# EAGLE design KEF_Weather_Station (EAGLE 9.6.2)
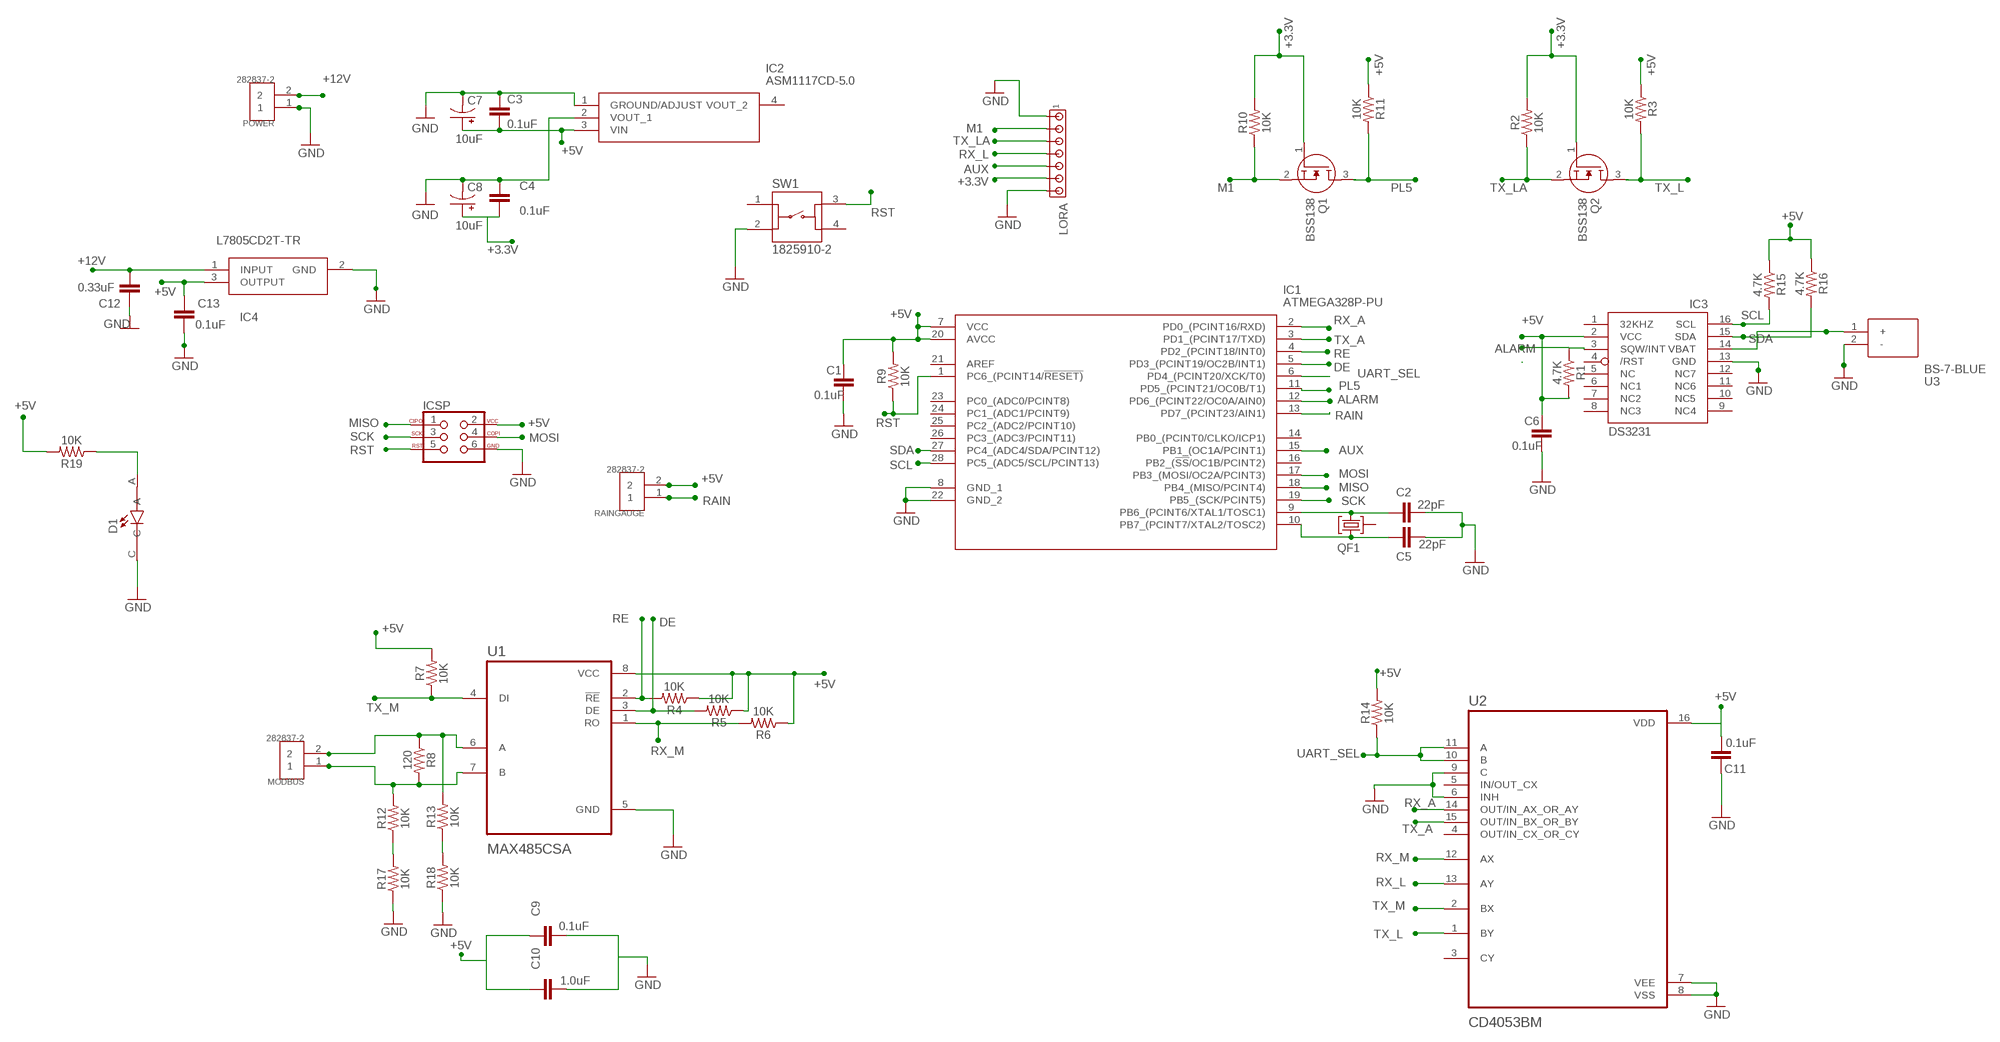
[diagram p0: schematic, sheet 1]

## Parts
C1  0.1uF  1.0UF-1206-50V-10%  [1206]
C2  22pF  1.0UF-1206-50V-10%  [1206]
C3  0.1uF  1.0UF-1206-50V-10%  [1206]
C4  0.1uF  1.0UF-1206-50V-10%  [1206]
C5  22pF  1.0UF-1206-50V-10%  [1206]
C6  0.1uF  1.0UF-1206-50V-10%  [1206]
C7  10uF  10UF-POLAR-EIA3216-16V-10%(TANT)  [EIA3216]
C8  10uF  10UF-POLAR-EIA3216-16V-10%(TANT)  [EIA3216]
C9  0.1uF  1.0UF-1206-50V-10%  [1206]
C10  1.0uF  1.0UF-1206-50V-10%  [1206]
C11  0.1uF  1.0UF-1206-50V-10%  [1206]
C12  0.33uF  1.0UF-1206-50V-10%  [1206]
C13  0.1uF  1.0UF-1206-50V-10%  [1206]
D1  LTST-C230KFKT  [LEDC3216X110]
IC1  ATMEGA328P-PU  [DIP794W53P254L3467H457Q28N]
IC2  ASM1117CD-5.0  [SOT229P700X180-4N]
IC3  DS3231/SO  [SO16W]
IC4  L7805CD2T-TR  [L7805CD2T]
ICSP  AVR_SPI_PROG_3X2NS  [2X3-NS]
LORA  MTA07-100  [10X07MTA]
MODBUS  282837-2  [TE_282837-2]
POWER  282837-2  [TE_282837-2]
Q1  BSS138  [SOT95P240X120-3N]
Q2  BSS138  [SOT95P240X120-3N]
QF1  8M10AHC49T  [HC49U]
R1  4.7K  10OHM-1206-1/4W-1%  [1206]
R2  10K  10OHM-1206-1/4W-1%  [1206]
R3  10K  10OHM-1206-1/4W-1%  [1206]
R4  10K  10OHM-1206-1/4W-1%  [1206]
R5  10K  10OHM-1206-1/4W-1%  [1206]
R6  10K  10OHM-1206-1/4W-1%  [1206]
R7  10K  10OHM-1206-1/4W-1%  [1206]
R8  120  10OHM-1206-1/4W-1%  [1206]
R9  10K  10OHM-1206-1/4W-1%  [1206]
R10  10K  10OHM-1206-1/4W-1%  [1206]
R11  10K  10OHM-1206-1/4W-1%  [1206]
R12  10K  10OHM-1206-1/4W-1%  [1206]
R13  10K  10OHM-1206-1/4W-1%  [1206]
R14  10K  10OHM-1206-1/4W-1%  [1206]
R15  4.7K  10OHM-1206-1/4W-1%  [1206]
R16  4.7K  10OHM-1206-1/4W-1%  [1206]
R17  10K  10OHM-1206-1/4W-1%  [1206]
R18  10K  10OHM-1206-1/4W-1%  [1206]
R19  10K  10OHM-1206-1/4W-1%  [1206]
RAINGAUGE  282837-2  [TE_282837-2]
SW1  1825910-2  [TE_1825910-2]
U1  MAX485CSA  [SOIC127P600X175-8N]
U2  CD4053BM  [SOIC127P600X175-16N]
U3  BS-7-BLUE  [BS-7-BLUE_1]

## Nets
+3.3V: C4.2 C8.+ LORA.6 Q1.1(G) Q2.1(G) R2.2 R10.2
+5V: C1.1 C3.2 C6.1 C7.+ C9.1 C10.1 C11.2 C13.1 IC1.7(VCC) IC1.20(AVCC) IC2.3(VIN) IC3.2(VCC) IC4.3(OUTPUT) ICSP.2 R1.2 R3.1 R4.1 R5.1 R6.1 R7.2 R9.2 R11.1 R14.2 R15.1 R16.1 R19.2 RAINGAUGE.2 U1.8(VCC) U2.16(VDD)
+12V: C12.1 IC4.1(INPUT) POWER.2
ALARM: IC1.12(PD6_(PCINT22/OC0A/AIN0)) IC3.3(SQW/INT) R1.1
AUX: IC1.15(PB1_(OC1A/PCINT1)) LORA.5
DE: IC1.5(PD3_(PCINT19/OC2B/INT1)) R5.2 U1.3(DE)
GND: C1.2 C2.2 C3.1 C4.1 C5.2 C6.2 C7.- C8.- C9.2 C10.2 C11.1 C12.2 C13.2 D1.C IC1.8(GND_1) IC1.22(GND_2) IC2.1(GROUND/ADJUST) IC2.2(VOUT_1) IC3.13(GND) IC4.2(GND) ICSP.6 LORA.1 LORA.7 POWER.1 R17.1 R18.1 SW1.2 U1.5(GND) U2.6(INH) U2.7(VEE) U2.8(VSS) U2.9(C) U3.2(-)
M1: LORA.2 Q1.2(S) R10.1
MISO: IC1.18(PB4_(MISO/PCINT4)) ICSP.1
MOSI: IC1.17(PB3_(MOSI/OC2A/PCINT3)) ICSP.4
N$1: R12.1 R17.2
N$2: IC3.14(VBAT) U3.1(+)
N$3: C5.1 IC1.10(PB7_(PCINT7/XTAL2/TOSC2)) QF1.1
N$4: C2.1 IC1.9(PB6_(PCINT6/XTAL1/TOSC1)) QF1.3
N$5: R13.1 R18.2
N$6: D1.A R19.1
N$10: MODBUS.1 R8.2 R12.2 U1.7(B)
N$11: MODBUS.2 R8.1 R13.2 U1.6(A)
PL5: IC1.11(PD5_(PCINT21/OC0B/T1)) Q1.3(D) R11.2
RAIN: IC1.13(PD7_(PCINT23/AIN1)) RAINGAUGE.1
RE: IC1.4(PD2_(PCINT18/INT0)) R4.2 U1.2(!RE)
RST: IC1.1(PC6_(PCINT14/!RESET)) ICSP.5 R9.1 SW1.3
RX_A: IC1.2(PD0_(PCINT16/RXD)) U2.14(OUT/IN_AX_OR_AY)
RX_L: LORA.4 U2.13(AY)
RX_M: R6.2 U1.1(RO) U2.12(AX)
SCK: IC1.19(PB5_(SCK/PCINT5)) ICSP.3
SCL: IC1.28(PC5_(ADC5/SCL/PCINT13)) IC3.16(SCL) R15.2
SDA: IC1.27(PC4_(ADC4/SDA/PCINT12)) IC3.15(SDA) R16.2
TX_A: IC1.3(PD1_(PCINT17/TXD)) U2.15(OUT/IN_BX_OR_BY)
TX_L: Q2.3(D) R3.2 U2.1(BY)
TX_LA: LORA.3 Q2.2(S) R2.1
TX_M: R7.1 U1.4(DI) U2.2(BX)
UART_SEL: IC1.6(PD4_(PCINT20/XCK/T0)) R14.1 U2.10(B) U2.11(A)
Unconnected: IC1.14(PB0_(PCINT0/CLKO/ICP1)) IC1.16(PB2_(!SS!/OC1B/PCINT2)) IC1.21(AREF) IC1.23(PC0_(ADC0/PCINT8)) IC1.24(PC1_(ADC1/PCINT9)) IC1.25(PC2_(ADC2/PCINT10)) IC1.26(PC3_(ADC3/PCINT11)) IC2.4(VOUT_2) IC3.1(32KHZ) IC3.4(/RST) IC3.5(NC) IC3.6(NC1) IC3.7(NC2) IC3.8(NC3) IC3.9(NC4) IC3.10(NC5) IC3.11(NC6) IC3.12(NC7) QF1.2 SW1.1 SW1.4 U2.3(CY) U2.4(OUT/IN_CX_OR_CY) U2.5(IN/OUT_CX)

## Library data of the parts
C1-C6 C9 C11-C13 = SparkFun-Capacitors:1.0UF: 1µF ceramic capacitors A capacitor is a passive two-terminal electrical component used to store electrical energy temporarily in an electric field.; PROD_ID: CAP-09822; VALUE: 1.0uF
C7 C8 = SparkFun-Capacitors:10UF-POLAR: 10.0µF polarized capacitors A capacitor is a passive two-terminal electrical component used to store electrical energy temporarily in an electric field.; PROD_ID: CAP-00811
C10 = SparkFun-Capacitors:1.0UF: 1µF ceramic capacitors A capacitor is a passive two-terminal electrical component used to store electrical energy temporarily in an electric field.; PROD_ID: CAP-09822
D1 = LTST-C230KFKT:LTST-C230KFKT: LED ORANGE CLEAR 1206 SMD Check availability <https://pricing.snapeda.com/parts/LTST-C230KFKT/Lite-On%20Inc./view-part?ref=eda>; AVAILABILITY: In Stock; DESCRIPTION: Orange 605nm LED Indication - Discrete 2V 1206 (3216 Metric); MF: Lite-On Inc.; MP: LTST-C230KFKT; PACKAGE: 1206 Lite-On; PRICE: None; PURCHASE-URL: https://pricing.snapeda.com/search/part/LTST-C230KFKT/?ref=eda
IC1 = SamacSys_Parts:ATMEGA328P-PU: MICROCHIP - ATMEGA328P-PU. - MICROCONTROLLER MCU, 8 BIT, ATMEGA, 20MHZ, DIP-28 Source: Datasheet <http://ww1.microchip.com/downloads/en/DeviceDoc/Atmel-42735-8-bit-AVR-Microcontroller-ATmega328-328P_Datasheet.pdf>; ARROW_PART_NUMBER: ATMEGA328P-PU; ARROW_PRICE-STOCK: https://www.arrow.com/en/products/atmega328p-pu/microchip-technology?region=nac; DESCRIPTION: MICROCHIP - ATMEGA328P-PU. - MICROCONTROLLER MCU, 8 BIT, ATMEGA, 20MHZ, DIP-28; HEIGHT: 4.572mm; MANUFACTURER_NAME: Microchip; MANUFACTURER_PART_NUMBER: ATMEGA328P-PU; MOUSER_PART_NUMBER: 556-ATMEGA328P-PU; MOUSER_PRICE-STOCK: https://www.mouser.co.uk/ProductDetail/Microchip-Technology-Atmel/ATMEGA328P-PU?qs=K8BHR703ZXguOQv3sKbWcg%3D%3D
IC2 = ASM1117CD-5.0:ASM1117CD-5.0: 1A LOW DROPOUT VOLTAGE REGULATOR Source: Datasheet <http://www.advanced-monolithic.com/pdf/ds1117.pdf>; DESCRIPTION: 1A LOW DROPOUT VOLTAGE REGULATOR; HEIGHT: 1.8mm; MANUFACTURER_NAME: Advanced Monolithic Systems; MANUFACTURER_PART_NUMBER: ASM1117CD-5.0
IC3 = DS3231:DS3231: Check availability <https://pricing.snapeda.com/parts/DS3231/Maxim%20Integrated/view-part?ref=eda>; AVAILABILITY: In Stock; DESCRIPTION: Real Time Clock (RTC) IC Clock/Calendar - I²C, 2-Wire Serial 8-SOIC (0.154, 3.90mm Width); MF: Maxim Integrated; MP: DS3231; PACKAGE: SOIC-16 Maxim Integrated; PRICE: None; PURCHASE-URL: https://pricing.snapeda.com/search/part/DS3231/?ref=eda
IC4 = L7805CD2T-TR:L7805CD2T-TR: L7805CD2T-TR, Linear Voltage Regulator, 1.5A 5 V, 3-Pin D2PAK Source: Datasheet <http://www.st.com/web/en/resource/technical/document/datasheet/CD00000444.pdf>; ARROW_PART_NUMBER: L7805CD2T-TR; ARROW_PRICE-STOCK: https://www.arrow.com/en/products/l7805cd2t-tr/stmicroelectronics?region=nac; DESCRIPTION: L7805CD2T-TR, Linear Voltage Regulator, 1.5A 5 V, 3-Pin D2PAK; HEIGHT: 4.56mm; MANUFACTURER_NAME: STMicroelectronics; MANUFACTURER_PART_NUMBER: L7805CD2T-TR; MOUSER_PART_NUMBER: 511-L7805CD2T-TR; MOUSER_PRICE-STOCK: https://www.mouser.co.uk/ProductDetail/STMicroelectronics/L7805CD2T-TR?qs=8tkG3v2%2F4sGtQPO74MZjHw%3D%3D
ICSP = SparkFun-Connectors:AVR_SPI_PROG_3X2: AVR ISP 6 Pin This is the reduced ISP connector for AVR programming. Common on Arduino. This footprint will take up less PCB space and can be used with a 10-pin to 6-pin adapter such as SKU: BOB-08508 **Special note about "TEST_POINT" package. The stop mask is on the top side, so if you want your programming test points to be on the bottom of your board, make sure to place this package on the bottom side of the board. This also ensure that the orientation to program from the bottom side will be correct. SparkFun Products: SparkFun ISP Pogo Adapter <https://www.sparkfun.com/products/11591> - NS Tiny AVR Programmer <https://www.sparkfun.com/products/11801> -PTH
LORA = con-amp:MTA07-100: AMP connector
MODBUS POWER RAINGAUGE = 282837-2:282837-2: TERM BLOCK 5.08MM 2POS SIDE ENTY Check availability <https://pricing.snapeda.com/parts/282837-2/TE%20Connectivity/view-part?ref=eda>; AVAILABILITY: In Stock; COMMENT: 282837-2; DESCRIPTION: Connector Terminal Blocks Receptacle 2 Position 5.08mm Solder Straight Thru-Hole 13.5A/Contact; EU_ROHS_COMPLIANCE: Compliant with Exemptions; MF: TE Connectivity; MP: 282837-2; PACKAGE: None; PRICE: None; PURCHASE-URL: https://pricing.snapeda.com/search/part/282837-2/?ref=eda
Q1 Q2 = SamacSys_Parts:BSS138: N-channel MOSFET,BSS138 0.2A 50V Source: Datasheet <https://www.onsemi.com/pub/Collateral/BSS138-D.PDF>; ARROW_PART_NUMBER: BSS138; ARROW_PRICE-STOCK: https://www.arrow.com/en/products/bss138/on-semiconductor; DESCRIPTION: N-channel MOSFET,BSS138 0.2A 50V; HEIGHT: 1.2mm; MANUFACTURER_NAME: ON Semiconductor; MANUFACTURER_PART_NUMBER: BSS138; MOUSER_PART_NUMBER: 512-BSS138; MOUSER_PRICE-STOCK: https://www.mouser.co.uk/ProductDetail/ON-Semiconductor-Fairchild/BSS138?qs=HK%252BeIG1iaahCeqBvjB4arg%3D%3D
QF1 = crystal:8M10AHC49T: Monolithic Crystal Filters Source: www.vanlong.com; OC_FARNELL: unknown; OC_NEWARK: unknown
R1-R19 = SparkFun-Resistors:10OHM: 10Ω resistor A resistor is a passive two-terminal electrical component that implements electrical resistance as a circuit element. Resistors act to reduce current flow, and, at the same time, act to lower voltage levels within circuits. - Wikipedia; PROD_ID: RES-08705; VALUE: 10
SW1 = 1825910-2:1825910-2: SWITCH TACTILE SPST-NO 0.05A 24V Check availability <https://pricing.snapeda.com/parts/1825910-2/TE%20Connectivity/view-part?ref=eda>; AVAILABILITY: In Stock; COMMENT: 1825910-2; DESCRIPTION: 50 mA SPST Round Actuator 160 Gram Force Tactile Pushbutton Switch; EU_ROHS_COMPLIANCE: Compliant; MF: TE Connectivity; MP: 1825910-2; PACKAGE: None; PRICE: None; PURCHASE-URL: https://pricing.snapeda.com/search/part/1825910-2/?ref=eda
U1 = MAX485CSA:MAX485CSA: Check availability <https://pricing.snapeda.com/parts/MAX485CSA/Maxim%20Integrated/view-part?ref=eda>; AVAILABILITY: In Stock; DESCRIPTION: 1/1 Transceiver Half RS422, RS485 8-SOIC; MF: Maxim Integrated; MP: MAX485CSA; PACKAGE: SOIC-8 Maxim; PRICE: None; PURCHASE-URL: https://pricing.snapeda.com/search/part/MAX485CSA/?ref=eda
U2 = CD4053BM:CD4053BM: Check availability <https://pricing.snapeda.com/parts/CD4053BM/Texas%20Instruments/view-part?ref=eda>; AVAILABILITY: In Stock; DESCRIPTION: 20-V, 2:1 (SPDT), 3-channel analog multiplexer with logic-level conversion 16-SOIC -55 to 125; MF: Texas Instruments; MP: CD4053BM; PACKAGE: SOIC-16 Texas Instruments; PRICE: None; PURCHASE-URL: https://pricing.snapeda.com/search/part/CD4053BM/?ref=eda
U3 = BS-7-BLUE:BS-7-BLUE: HOLDER CR2032 Source: Datasheet <http://www.memoryprotectiondevices.com/datasheets/BS-7-BLUE-datasheet.pdf>; DESCRIPTION: HOLDER CR2032; HEIGHT: mm; MANUFACTURER_NAME: MPD (Memory Protection Devices); MANUFACTURER_PART_NUMBER: BS-7-BLUE

## Board
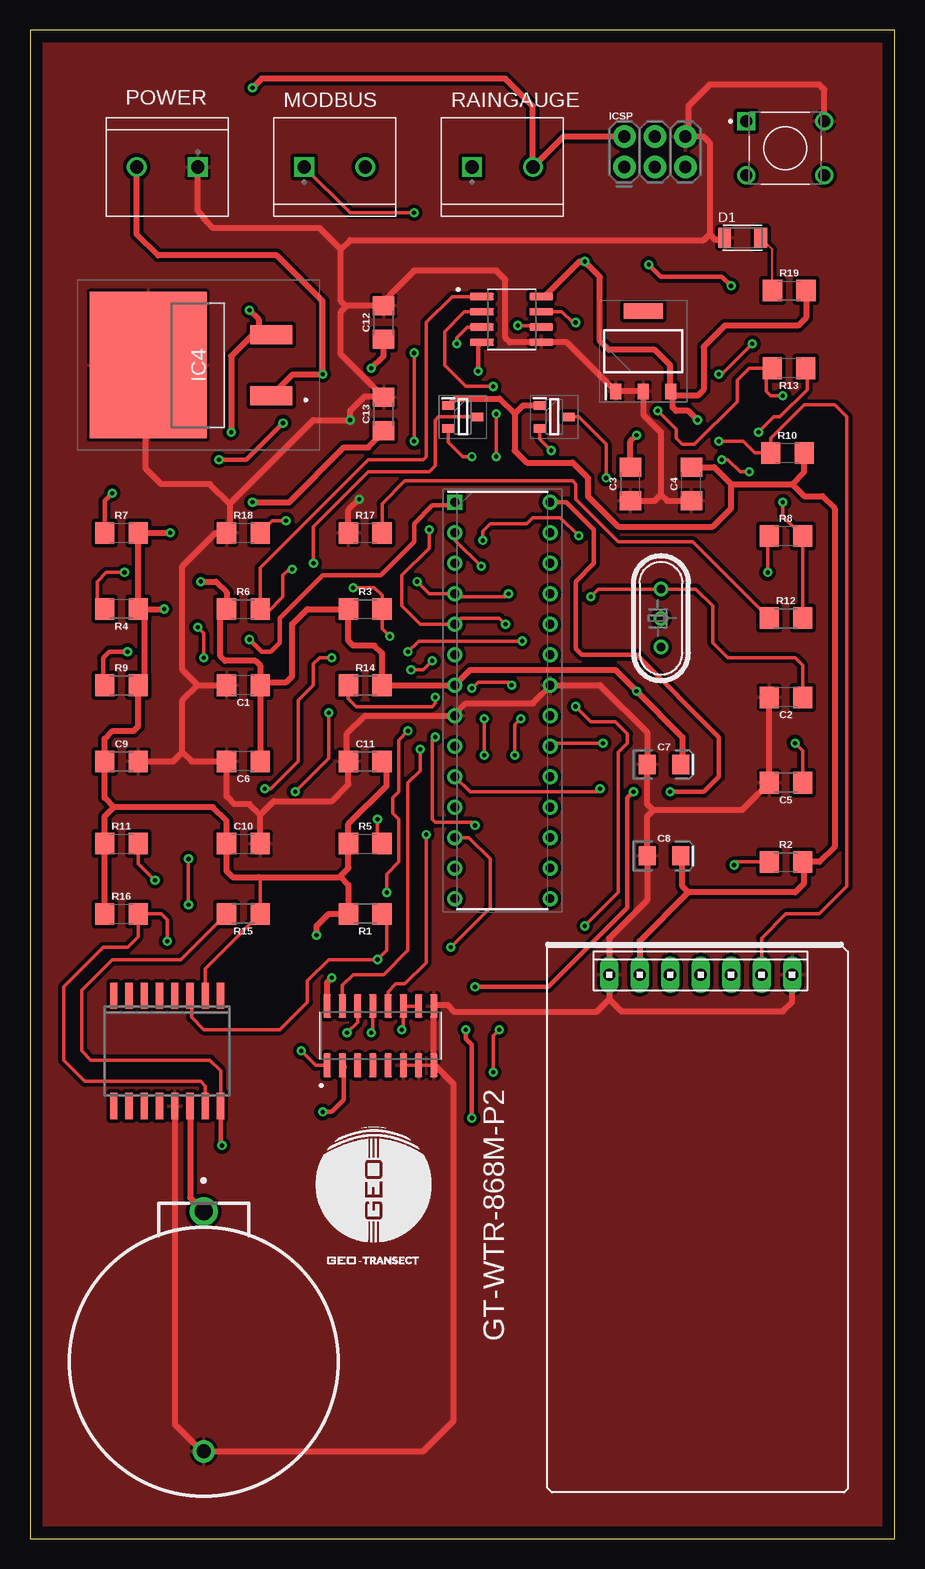
[diagram p1: board, top side]
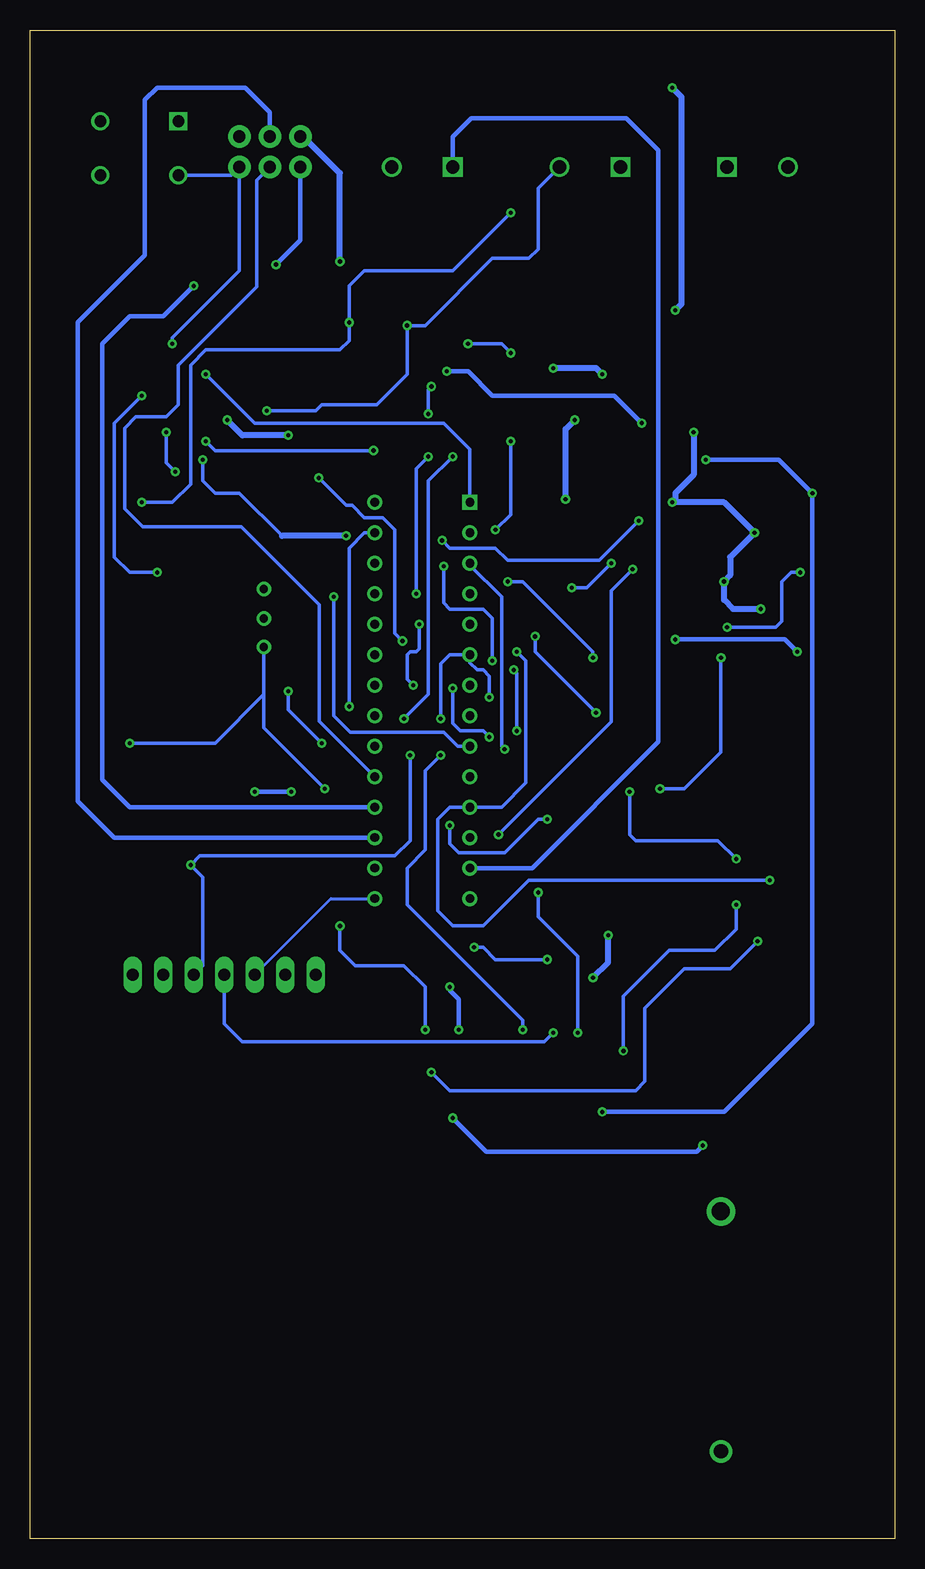
[diagram p2: board, bottom side, seen from below]

Size 72.06 x 125.72 mm. Coordinates in mm from the lower left corner, seen from the top.
Outline: 72.06,0 72.06,125.72 0,125.72 0,0 72.06,0
Copper layers (1*16): Top 0.035mm / dielectric 1.5mm / Bottom 0.035mm
Design rules "default": minimum track width 6mil, minimum drill 0.35mm, track to track 6mil, track to pad 6mil, pad to pad 6mil, via to via 6mil, smd to smd 6mil, copper to edge 40mil, drill to drill 6mil, minimum pad ring 10mil, minimum via ring 8mil, stop-mask expansion 4mil, vias tented up to drill 0mil, thermal gap 10mil

### Footprints (pad centres in the part's own frame; a part is rotated, then mirrored left to right if it is on the bottom)
1206 = smd 1.6 x 1.8: 1 -1.4,0; 2 1.4,0
EIA3216 = smd 1.4 x 1.6: + 1.4,0; - -1.4,0
LEDC3216X110 = smd 1.1 x 1.73: A 1.51,0; C -1.51,0
DIP794W53P254L3467H457Q28N = drill 0.733 pad 1.133 square: 1 -3.969,16.51 | drill 0.733 pad 1.133: 2 -3.969,13.97; 3 -3.969,11.43; 4 -3.969,8.89; 5 -3.969,6.35; 6 -3.969,3.81; 7 -3.969,1.27; 8 -3.969,-1.27; 9 -3.969,-3.81; 10 -3.969,-6.35; 11 -3.969,-8.89; 12 -3.969,-11.43; 13 -3.969,-13.97; 14 -3.969,-16.51; 15 3.969,-16.51; 16 3.969,-13.97; 17 3.969,-11.43; 18 3.969,-8.89; 19 3.969,-6.35; 20 3.969,-3.81; 21 3.969,-1.27; 22 3.969,1.27; 23 3.969,3.81; 24 3.969,6.35; 25 3.969,8.89; 26 3.969,11.43; 27 3.969,13.97; 28 3.969,16.51
SOT229P700X180-4N = smd 1.3 x 0.95: 1 -3.35,2.29; 2 -3.35,0; 3 -3.35,-2.29 | smd 1.3 x 3.25: 4 3.35,0
SO16W = smd 0.6 x 2.2: 1 -4.445,-4.6; 2 -3.175,-4.6; 3 -1.905,-4.6; 4 -0.635,-4.6; 5 0.635,-4.6; 6 1.905,-4.6; 7 3.175,-4.6; 8 4.445,-4.6; 9 4.445,4.6; 10 3.175,4.6; 11 1.905,4.6; 12 0.635,4.6; 13 -0.635,4.6; 14 -1.905,4.6; 15 -3.175,4.6; 16 -4.445,4.6
L7805CD2T = smd 1.6 x 3.5: 1 -2.54,-5.138; 3 2.54,-5.138 | smd 12.2 x 9.75: 2 0,5.138
2X3-NS = drill 1.016 pad 1.88: 1 -2.54,-1.27; 2 -2.54,1.27; 3 0,-1.27; 4 0,1.27; 5 2.54,-1.27; 6 2.54,1.27
10X07MTA = drill 1.016 long: 1 7.62,0; 2 5.08,0; 3 2.54,0; 4 0,0; 5 -2.54,0; 6 -5.08,0; 7 -7.62,0
TE_282837-2 = drill 1.1 square: 1 -2.54,0 | drill 1.1: 2 2.54,0
SOT95P240X120-3N = smd 1 x 0.7: 1 -1.2,0.95; 2 -1.2,-0.95; 3 1.2,0
HC49U = drill 0.7 pad 1.2: 1 -2.413,0; 2 -0.027,0; 3 2.413,0
TE_1825910-2 = drill 0.99 square: 1 0,0 | drill 0.99: 2 6.5,0; 3 0,-4.5; 4 6.5,-4.5
SOIC127P600X175-8N = smd 1.97 x 0.59: 1 -2.475,1.905; 2 -2.475,0.635; 3 -2.475,-0.635; 4 -2.475,-1.905; 5 2.475,-1.905; 6 2.475,-0.635; 7 2.475,0.635; 8 2.475,1.905
SOIC127P600X175-16N = smd 1.97 x 0.6: 1 -2.475,4.445; 2 -2.475,3.175; 3 -2.475,1.905; 4 -2.475,0.635; 5 -2.475,-0.635; 6 -2.475,-1.905; 7 -2.475,-3.175; 8 -2.475,-4.445; 9 2.475,-4.445; 10 2.475,-3.175; 11 2.475,-1.905; 12 2.475,-0.635; 13 2.475,0.635; 14 2.475,1.905; 15 2.475,3.175; 16 2.475,4.445
BS-7-BLUE_1 = drill 1.5 pad 2.35: 1 23.71,0 | drill 1.17 pad 1.85: 2 3.71,0

### Placement (x,y rotation side)
C1  17.78,71.12 180 top
C2  62.99,70.1 180 top
C3  50.04,87.88 90 top
C4  55.12,87.88 90 top
C5  62.99,62.99 180 top
C6  17.78,64.77 180 top
C7  52.83,64.52 0 top
C8  52.83,56.9 0 top
C9  7.62,64.77 0 top
C10  17.78,57.91 0 top
C11  27.94,64.77 0 top
C12  29.46,101.35 90 top
C13  29.46,93.73 90 top
D1  59.39,108.41 0 top
IC1  39.37,69.85 0 top
IC2  51.1,98.96 90 top
IC3  11.43,40.64 180 top
IC4  14.99,97.79 90 top
ICSP  52.07,115.57 0 top
LORA  55.88,46.99 0 top
MODBUS  25.4,114.3 0 top
POWER  11.43,114.3 180 top
Q1  43.69,93.47 0 top
Q2  36.07,93.47 0 top
QF1  52.58,76.71 90 top
R1  27.94,52.07 180 top
R2  62.99,56.39 0 top
R3  27.94,77.47 0 top
R4  7.62,77.47 180 top
R5  27.94,57.91 0 top
R6  17.78,77.47 0 top
R7  7.62,83.82 0 top
R8  62.99,83.57 0 top
R9  7.62,71.12 0 top
R10  63.12,90.47 0 top
R11  7.62,57.91 0 top
R12  62.99,76.71 0 top
R13  63.25,97.54 180 top
R14  27.94,71.12 0 top
R15  17.78,52.07 180 top
R16  7.62,52.07 0 top
R17  27.94,83.82 0 top
R18  17.78,83.82 0 top
R19  63.27,104.01 0 top
RAINGAUGE  39.37,114.3 0 top
SW1  59.69,118.11 0 top
U1  40.13,101.6 0 top
U2  29.21,41.91 90 top
U3  14.48,3.56 90 top

### Tracks (layer width: path | path; a pad name or v marks a point on that pad's centre or on a via)
+3.3V
  Top 0.152: 63.88,53.98 63.75,53.85 | 54.36,56.77 C8.+
  Top 0.508: C4.2 57.02,89.28 58.42,87.88 | 58.42,87.88 63.5,87.88 | R10.2 64.52,88.9 63.5,87.88 | 63.5,87.88 64.52,86.87 66.04,86.87 67.06,85.85 67.06,57.66 65.79,56.39 64.52,56.39 | 64.52,56.39 R2.2 | 54.36,56.77 54.36,54.36 54.86,53.85 | 54.86,53.85 63.75,53.85 64.52,54.61 64.52,56.39 | 54.86,53.85 50.8,49.78 LORA.6 | Q1.1 41.08,94.42 40.39,93.73 | 40.39,93.73 40.39,90.68 41.4,89.66 45.21,89.66 46.48,88.39 46.48,86.87 49.02,84.33 56.9,84.33 58.42,85.85 58.42,87.88 | Q2.1 35.44,95 39.12,95 40.39,93.73
+5V  (via drill 0.35)
  Top 0.152: 53.75,95.25 53.55,95.46 | R7.2 9.14,83.82 9.02,83.7 | 29.72,64.39 C11.2 | C1.1 19.43,71.37 | 25.78,55.12 25.84,55.18
  Top 0.305: U1.8 42.86,103.5 | 19.05,55.12 19.18,54.99 R15.1 14.61,47.49 IC3.2 | IC1.20 43.59,66.29 v47.75,66.29
  Top 0.381: 29.46,92.2 C13.1
  Top 0.508: R19.2 64.67,101.75 64.01,101.09 57.91,101.09 56.13,99.31 56.13,95.76 55.63,95.25 53.75,95.25 | ICSP.2 44.45,116.84 RAINGAUGE.2 41.91,119.38 39.62,121.67 19.3,121.67 v18.54,120.9 | 42.86,103.5 45.78,106.43 v46.23,106.43 47.5,105.16 47.5,99.82 48.26,99.06 52.07,99.06 53.34,97.79 53.34,95.66 IC2.3 53.55,95.46 53.55,94.28 53.85,93.98 54.86,93.98 v55.63,93.22 | 9.14,83.82 v11.68,83.82 | v14.22,79.76 15.49,79.76 16.38,78.87 R6.1 15.87,76.96 15.87,73.54 16.26,73.15 18.8,73.15 19.18,72.77 C1.1 C6.1 | R4.1 9.02,83.7 | R4.1 v11.18,77.47 | R4.1 9.53,76.96 9.53,71.63 R9.2 9.02,67.69 8.64,67.31 6.86,67.31 6.22,66.67 C9.1 6.22,61.72 6.98,60.96 | R16.1 R11.1 6.22,60.2 6.98,60.96 | 29.72,64.39 29.72,62.74 26.54,59.56 R5.1 26.54,55.88 25.84,55.18 26.54,54.49 R1.2 24.89,52.07 23.88,51.05 v23.88,50.29 | 19.43,71.37 21.34,71.37 21.84,71.88 21.84,76.2 23.11,77.47 R3.1 26.54,74.81 26.92,74.42 28.7,74.42 29.34,73.78 R14.2 IC1.7 36.67,72.39 48.77,72.39 v50.55,70.61 54.36,66.8 54.36,64.64 C7.+ | 25.78,55.12 19.05,55.12 16.89,55.12 16.38,55.63 C10.1 16.38,59.82 15.24,60.96 6.98,60.96 | C3.2 50.04,91.44 v50.55,91.95 | IC4.3 19.05,100.33 | 19.05,100.33 18.54,100.33 16.76,98.55 v16.76,92.2 | v18.54,86.36 21.59,86.36 26.16,90.93 28.19,90.93 29.46,92.2 | v18.29,102.36 19.05,101.6 19.05,100.33 | U2.16 24.77,46.35 v25.15,46.74
  Bottom 0.152: 49.28,116.84 ICSP.2
  Bottom 0.305: v47.75,66.29 50.55,69.09 v50.55,70.61
  Bottom 0.508: v46.23,106.43 46.23,113.79 49.28,116.84 | v11.18,77.47 13.46,77.47 14.22,78.23 v14.22,79.76 13.72,80.26 13.72,81.79 v11.68,83.82 14.22,86.36 v18.54,86.36 18.29,86.61 18.29,87.12 16.76,88.65 v16.76,92.2 | v50.55,91.95 54.36,91.95 v55.63,93.22 | v18.29,102.36 17.78,102.87 17.78,120.14 v18.54,120.9 | v25.15,46.74 23.88,48.01 v23.88,50.29
+12V  (via drill 0.35)
  Top 0.508: IC4.1 21.9,97.03 v24.38,97.03 24.38,103.12 20.57,106.93 10.67,106.93 8.89,108.71 POWER.2 | v28.45,97.54 29.46,98.55 C12.1
  Bottom 0.508: v24.38,97.03 24.89,97.54 v28.45,97.54
ALARM  (via drill 0.35)
  Top 0.152: 29.72,51.69 R1.1
  Top 0.305: 29.72,51.69 29.72,49.02 v28.96,48.26 24.89,48.26 23.11,46.48 23.11,44.7 20.83,42.42 14.48,42.42 13.46,43.43 13.46,45.11 IC3.3 | v35.05,49.28 38.35,52.58 38.35,56.64 36.58,58.42 IC1.12
  Bottom 0.305: v28.96,48.26 33.27,48.26 34.29,49.28 v35.05,49.28
AUX
  Bottom 0.254: LORA.5 46.99,53.34 IC1.15
DE  (via drill 0.35)
  Top 0.305: U1.3 36.45,100.97 35.56,100.08 v35.56,99.57 | v32,98.81 v32,91.44 | v33.27,84.07 33.27,82.55 30.99,80.26 30.99,77.72 32.51,76.2 IC1.5 35.91,76.71 39.12,76.71 v39.62,76.2 | R5.2 28.96,58.3 v28.96,59.94 | v37.08,59.44 36.83,59.69 33.78,59.69 33.53,59.94 33.53,66.55 v33.78,66.8 | v36.83,70.87 37.34,71.37 39.88,71.37 v40.13,71.12
  Bottom 0.305: v35.56,99.57 32.77,99.57 v32,98.81 | v32,91.44 32,85.34 v33.27,84.07 | v28.96,59.94 29.72,59.94 32.51,57.15 36.32,57.15 37.08,57.91 v37.08,59.44 | v33.78,66.8 34.29,67.31 36.21,67.31 36.83,67.93 v36.83,70.87 | v40.13,71.12 40.64,71.63 40.64,73.66 40.39,73.91 39.88,73.91 39.62,74.17 v39.62,76.2
GND  (via drill 0.35)
  Top 0.152: C13.2 29.4,95.19 | 26.42,102.75 26.29,102.75 | 29.46,103.12 C12.2 | 15.49,83.82 R18.1 | 19.18,60.32 19.18,60.33 | C11.1 26.42,64.89 | 57.99,108.54 57.88,108.42 D1.C 57.67,108.2 | 54.86,116.84 ICSP.6 | IC1.22 43.43,71.12 | 9.65,97.59 IC4.2
  Top 0.305: 14.32,7.27 U3.2 | 33.72,39.44 U2.8 U2.7 U2.6
  Top 0.508: 25.91,107.44 25.91,103.12 26.29,102.75 | 25.91,107.44 24.13,109.22 15.24,109.22 14.73,109.73 13.97,110.68 POWER.1 | C12.2 26.42,102.75 25.91,102.24 25.91,98.68 29.4,95.19 27.88,95.19 26.67,93.98 v26.67,93.22 23.62,93.22 16.64,86.23 16.63,86.24 | 29.46,103.12 32,105.66 38.86,105.66 39.62,104.9 39.62,100.08 40.01,99.69 U1.5 44.73,99.69 IC2.1 IC2.2 51.1,93.67 52.58,92.2 52.58,86.99 | R17.1 26.54,85.72 v27.43,86.61 | 12.7,65.53 11.94,64.77 C9.2 | 12.7,65.53 13.46,64.77 C6.2 16.38,61.85 17.02,61.21 18.29,61.21 19.18,60.32 C10.2 | 12.7,65.53 12.7,69.85 13.97,71.12 | 13.97,71.12 C1.2 | 13.97,71.12 12.7,72.39 12.7,81.03 15.49,83.82 | 16.63,86.24 16.63,84.07 R18.1 | C11.1 26.54,62.86 25.15,61.47 20.32,61.47 19.18,60.33 | 26.42,64.89 26.42,67.06 27.94,68.58 IC1.8 35.4,68.67 36.32,69.6 41.91,69.6 43.43,71.12 47.5,71.12 51.43,67.19 C7.- 51.43,61.21 51.94,60.71 | C2.2 C5.2 59.31,60.71 51.94,60.71 | 51.94,60.71 51.43,60.2 C8.- 51.43,53.21 48.26,50.04 LORA.7 48.26,44.96 | C3.1 52.07,86.48 52.58,86.99 | C4.1 53.09,86.48 52.58,86.99 | 56.64,108.71 56.64,116.33 56.13,116.84 54.86,116.84 54.86,119.38 56.64,121.16 65.79,121.16 66.19,120.75 SW1.2 | 56.64,108.71 56.13,108.2 26.67,108.2 25.91,107.44 | 56.64,108.71 57.15,108.2 57.67,108.2 | 16.63,86.24 14.99,87.88 10.92,87.88 9.65,89.15 9.65,97.59 | IC3.13 12.06,9.53 14.32,7.27 | U2.8 U2.9 33.72,44.45 34.8,44.45 35.37,43.88 47.18,43.88 48.26,44.96 | U3.2 32.77,7.27 35.31,9.81 35.31,37.85 33.72,39.44 | LORA.1 63.5,44.7 62.74,43.94 49.28,43.94 48.26,44.96
  Bottom 0.508: v27.43,86.61 27.43,92.46 v26.67,93.22
  pour Top (isolate 0.305): 0,125.73 72.14,125.73 72.14,0 0,0
M1  (via drill 0.35)
  Top 0.305: v57.4,91.44 59.44,91.44 60.4,90.47 R10.1 61.72,91.69 64.52,94.49 67.06,94.49 68.07,93.47 68.07,54.36 65.79,52.07 62.99,52.07 60.96,50.04 LORA.2 | v43.43,90.68 42.49,91.62 Q1.2
  Bottom 0.305: v57.4,91.44 56.64,90.68 v43.43,90.68
MISO  (via drill 0.35)
  Top 0.381: v51.56,106.17 52.58,105.16 57.66,105.16 v58.42,104.39
  Bottom 0.381: ICSP.1 49.53,108.2 v51.56,106.17 | v58.42,104.39 60.96,101.85 63.75,101.85 66.04,99.57 66.04,63.25 63.75,60.96 IC1.18
MOSI
  Bottom 0.381: ICSP.4 52.07,118.87 54.1,120.9 61.47,120.9 62.48,119.89 62.48,106.93 68.07,101.35 68.07,61.47 65.02,58.42 IC1.17
N$1
  Top 0.305: R12.1 55.24,83.06 49.02,83.06 45.47,86.61 45.47,87.88 45.21,88.14 31.24,88.14 29.34,86.24 R17.2
N$2
  Top 0.508: IC3.14 13.34,28.41 U3.1
N$3  (via drill 0.35)
  Top 0.305: C5.1 64.39,65.66 v63.75,66.29 | v47.5,62.48 47.24,62.23 36.67,62.23 IC1.10
  Bottom 0.305: v63.75,66.29 56.64,66.29 52.58,70.36 | QF1.1 52.58,70.36 | 52.58,70.36 52.58,67.56 v47.5,62.48
N$4  (via drill 0.35)
  Top 0.305: C2.1 64.39,72.77 63.75,73.41 58.17,73.41 56.9,74.68 56.9,77.72 55.5,79.12 QF1.3 47.37,79.12 v46.74,78.49
  Bottom 0.305: v46.74,78.49 46.74,68.58 45.38,67.22 37.6,67.22 36.42,66.04 IC1.9
N$5  (via drill 0.35)
  Top 0.305: R18.2 20.2,84.84 v21.34,84.84 | v37.72,83.19 37.72,83.95 38.35,84.58 41.4,84.58 41.91,85.09 44.2,85.09 v45.72,83.57 | v57.66,89.92 58.17,89.92 59.18,88.9 v59.94,88.9 | v60.71,92.2 61.98,93.47 62.48,93.47 64.77,95.76 64.77,97.41 R13.1
  Bottom 0.305: v21.34,84.84 24.64,81.53 32.26,81.53 33.27,82.55 37.08,82.55 v37.72,83.19 | v57.66,89.92 57.66,88.14 56.64,87.12 54.61,87.12 51.05,83.57 | v59.94,88.9 60.71,89.66 v60.71,92.2
  Bottom 0.508: v45.72,83.57 51.05,83.57
N$6
  Top 0.152: R19.1 61.87,107.43 D1.A
N$10  (via drill 0.35)
  Top 0.152: v45.47,101.35 45.21,101.35 | 32.26,110.49 v32,110.49
  Top 0.305: R12.2 R8.2 62.74,85.22 v62.74,86.36 | U1.7 44.32,102.23 45.21,101.35 | MODBUS.1 26.67,110.49 v32,110.49
  Bottom 0.305: v62.74,86.36 60.2,86.36 58.67,87.88 58.67,97.79 57.4,99.06 46.23,99.06 45.47,99.82 v45.47,101.35 45.47,104.39 44.2,105.66 36.83,105.66 v32,110.49
N$11  (via drill 0.35)
  Top 0.152: 42.48,101.09 U1.6
  Top 0.305: v40.64,101.09 42.48,101.09 | v62.74,95.25 61.72,95.25 61.34,95.63 61.34,97.03 R13.2 59.94,97.54 58.93,96.52 58.93,94.74 55.37,91.19 54.36,91.19 53.85,91.69 53.85,92.46 v52.32,93.98 | v61.47,80.52 61.47,83.44 R8.1
  Bottom 0.305: MODBUS.2 29.72,112.52 29.72,107.44 30.48,106.68 33.53,106.68 39.12,101.09 v40.64,101.09 40.64,97.03 43.18,94.49 47.75,94.49 48.26,93.98 v52.32,93.98 | v62.74,95.25 65.02,92.96 65.02,81.79 63.75,80.52 v61.47,80.52
PL5  (via drill 0.35)
  Top 0.305: R11.2 9.02,56.26 v10.41,54.86 | Q1.3 45.72,93.47 48.01,91.19 v48.01,88.39 | v41.02,74.8 32.38,74.8 v31.5,73.91
  Bottom 0.305: v10.41,54.86 30.48,54.86 34.29,51.05 36.83,51.05 38.1,52.32 38.1,59.94 37.08,60.96 35.56,60.96 IC1.11 32.77,60.96 30.73,62.99 30.73,73.15 v31.5,73.91 | v48.01,88.39 45.72,86.11 45.21,86.11 44.2,85.09 42.67,85.09 41.66,84.07 41.66,75.44 v41.02,74.8 40.89,74.68
RAIN
  Bottom 0.381: RAINGAUGE.1 36.83,116.84 35.31,118.36 22.35,118.36 19.7,115.71 19.7,66.41 30.23,55.88 IC1.13
RE  (via drill 0.35)
  Top 0.305: U1.2 36.2,102.23 34.54,100.58 34.54,97.79 36.32,96.01 v38.61,96.01 | v39.88,78.74 39.62,78.49 35.66,78.49 IC1.4 33.27,78.74 v32.26,79.76 | v38.86,93.73 v38.86,90.17 | R4.2 5.59,78.1 5.59,79.76 6.35,80.52 v7.87,80.52 | v13.97,75.95 14.48,75.44 v14.48,73.41 | v19.56,62.48 20.07,62.48 22.35,64.77 22.35,69.85 23.62,71.12 23.62,72.9 24.13,73.41 v25.15,73.41
  Bottom 0.305: v38.86,90.17 39.88,89.15 v39.88,78.74 | v38.61,96.01 38.86,95.76 v38.86,93.73 | v7.87,80.52 8.64,80.52 9.4,79.76 9.4,76.45 9.91,75.95 v13.97,75.95 | v14.48,73.41 14.48,65.53 17.53,62.48 v19.56,62.48 | v19.56,62.48 | v25.15,73.41 25.15,73.91 30.99,79.76 v32.26,79.76
RST  (via drill 0.35)
  Top 0.152: 57.66,97.03 v57.4,97.03
  Top 0.305: v60.2,99.57 57.66,97.03
  Top 0.381: IC1.1 35.15,86.11 33.53,86.11 32,84.58 32,83.06 29.21,80.26 24.38,80.26 20.83,76.71 20.83,74.68 20.07,73.91 19.3,73.91 v18.29,74.93 | R9.1 6.1,71.24 6.1,73.41 6.6,73.91 v8.13,73.91
  Bottom 0.305: SW1.3 55.3,113.61 ICSP.5 54.61,105.66 60.2,100.08 v60.2,99.57 | v57.4,97.03 53.34,92.96 37.59,92.96 35.4,90.77 IC1.1
  Bottom 0.381: v18.29,74.93 9.14,74.93 v8.13,73.91
RX_A  (via drill 0.35)
  Top 0.305: U2.14 27.3,43.05 v26.42,42.16 | v29.72,53.85 29.72,55.37 30.73,56.39 30.73,59.94 30.23,60.45 30.23,61.72 30.73,62.23 30.73,66.55 v31.5,67.31 | v31.75,72.39 32.77,72.39 v33.53,73.15 | v37.59,81.03 35.4,83.22 IC1.2
  Bottom 0.305: v26.42,42.16 26.42,48.51 29.72,51.82 v29.72,53.85 | v31.5,67.31 31.5,72.14 v31.75,72.39 | v33.53,73.15 33.53,76.71 34.29,77.47 37.08,77.47 37.59,77.98 v37.59,81.03
RX_L  (via drill 0.35)
  Top 0.305: U2.13 28.57,42.29 v28.45,42.16
  Bottom 0.305: v28.45,42.16 29.21,41.4 54.36,41.4 55.88,42.93 LORA.4
RX_M  (via drill 0.35)
  Top 0.305: U1.1 35.18,103.5 33.02,101.35 33.02,90.17 32.77,89.92 28.19,89.92 19.18,80.9 R6.2 19.43,77.22 19.81,77.22 21.08,78.49 21.08,80.26 21.59,80.77 v21.84,80.77 | U2.12 29.84,45.59 30.48,46.23 31.24,46.23 33.02,48.01 v33.02,58.67
  Bottom 0.305: v33.02,58.67 23.62,68.07 23.62,78.99 v21.84,80.77
SCK
  Bottom 0.305: IC1.19 47.97,68.13 47.97,77.83 54.45,84.31 62.67,84.31 64.18,85.82 64.18,92.46 64.18,92.53 63.25,93.47 60.71,93.47 59.69,94.49 59.69,97.79 53.17,104.31 53.17,113.2 ICSP.3
SCL  (via drill 0.35)
  Top 0.305: IC3.16 15.88,38.99 14.99,39.88 5.08,39.88 4.32,40.64 4.32,45.72 6.86,48.26 12.57,48.26 R15.2
  Top 0.381: IC1.28 44.7,86.36 46.02,85.05 46.99,84.08 46.99,81.28 45.47,79.76 45.47,74.17 45.97,73.66 50.55,73.66 57.4,66.8 57.4,63.5 56.13,62.23 v53.34,62.23 | v50.29,62.23 49.78,61.72 49.78,52.58 43.18,45.97 v37.08,45.97 | v36.32,42.42 36.32,41.66 36.83,41.15 v36.83,35.05 | v16,32.77 15.88,32.89 IC3.16
  Bottom 0.381: v53.34,62.23 v50.29,62.23 | v37.08,45.97 37.08,45.72 36.32,44.96 v36.32,42.42 | v36.83,35.05 34.04,32.26 16.51,32.26 v16,32.77
SDA  (via drill 0.35)
  Top 0.305: IC3.15 14.61,37.72 14.22,38.1 4.57,38.1 2.79,39.88 2.79,45.97 6.1,49.28 8.13,49.28 9.02,50.17 R16.2 10.92,52.07 11.43,51.56 v11.43,49.78 | v38.61,38.86 38.61,41.91 v39.12,42.42 | v46.23,51.05 49.02,53.85 49.02,65.53 49.78,66.29 49.78,67.06 48.77,68.07 46.74,68.07 v45.47,69.34
  Bottom 0.305: v11.43,49.78 13.72,47.5 17.53,47.5 20.83,44.2 20.83,38.1 21.59,37.34 37.08,37.34 v38.61,38.86 | v39.12,42.42 39.12,45.97 40.89,47.75 44.96,47.75 46.23,49.02 v46.23,51.05 | v45.47,69.34 45.47,82.55 44.2,83.82 IC1.27
TX_A  (via drill 0.35)
  Top 0.305: U2.15 26.04,46.1 26.92,46.99 29.46,46.99 31.5,49.02 31.5,62.99 32.51,64.01 v32.51,65.79
  Bottom 0.305: v32.51,65.79 32.77,66.04 32.77,78.49 35.4,81.12 IC1.3
TX_L  (via drill 0.35)
  Top 0.305: U2.1 23.81,39.44 v22.61,40.64 | v13.21,52.83 v13.21,56.64 | v22.1,62.25 24.89,65.05 v24.89,68.83 | v29.97,75.18 29.34,75.82 R3.2 29.34,78.61 28.7,79.25 v26.92,79.25 | Q2.3 34.04,93.47 33.78,93.22 33.78,89.41 33.27,88.9 28.19,88.9 23.62,84.33 v23.62,81.28
  Bottom 0.305: v22.61,40.64 22.61,45.21 18.8,49.02 14.99,49.02 13.21,50.8 v13.21,52.83 | v13.21,56.64 14.73,58.17 21.59,58.17 22.1,58.67 v22.1,62.25 | v24.89,68.83 29.97,73.91 v29.97,75.18 | v23.62,81.28 25.65,79.25 v26.92,79.25
TX_LA  (via drill 0.35)
  Top 0.305: R2.1 58.93,56.39 v58.67,56.13 | v36.83,90.17 36.07,90.17 34.87,91.37 Q2.2 | v40.39,65.28 40.39,67.82 v40.89,68.33
  Bottom 0.305: LORA.3 57.66,47.75 57.66,55.12 v58.67,56.13 57.91,56.9 41.66,56.9 40.39,58.17 v40.39,65.28 | v40.89,68.33 38.86,70.36 38.86,88.14 v36.83,90.17
TX_M  (via drill 0.35)
  Top 0.381: R7.1 6.22,86.48 v6.86,87.12 | v24.38,35.56 25.15,35.56 26.16,36.58 26.16,39.31 | v15.75,89.92 18.03,89.92 v21.08,92.96 | v37.34,97.28 37.34,99.38 U1.4
  Top 0.508: 26.16,39.31 U2.2
  Bottom 0.381: v24.38,35.56 14.22,35.56 6.86,42.93 v6.86,87.12 9.65,89.92 v15.75,89.92 | v21.08,92.96 23.37,95.25 33.53,95.25 35.56,97.28 v37.34,97.28
UART_SEL  (via drill 0.35)
  Top 0.305: v30.99,42.42 31.11,42.55 U2.11 U2.10 | v37.85,68.33 v37.85,65.28 | R14.1 26.54,69.98 27.18,69.34 33.51,69.34 33.78,69.62 v33.78,70.13
  Bottom 0.305: v30.99,42.42 30.99,43.18 40.64,52.83 40.64,55.88 39.12,57.4 39.12,64.01 v37.85,65.28 | v37.85,68.33 37.85,72.9 37.08,73.66 IC1.6 35.4,72.99 34.8,72.39 34.29,72.39 33.78,71.88 v33.78,70.13

### Text on the board
tPlace: GT-WTR-868M-P2